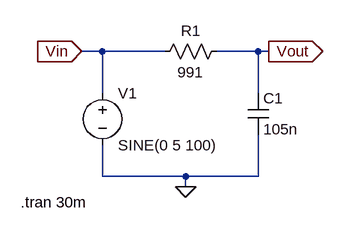
[diagram p0: schematic Draft8.asc]
Draft8.asc, the LTspice schematic file:
Version 4
SHEET 1 880 680
WIRE 16 48 -16 48
WIRE 112 48 16 48
WIRE 256 48 192 48
WIRE 272 48 256 48
WIRE 16 112 16 48
WIRE 256 112 256 48
WIRE 16 240 16 192
WIRE 144 240 16 240
WIRE 256 240 256 176
WIRE 256 240 144 240
WIRE 144 256 144 240
FLAG 144 256 0
FLAG -16 48 Vin
IOPIN -16 48 In
FLAG 272 48 Vout
IOPIN 272 48 Out
SYMBOL res 208 32 R90
WINDOW 0 0 56 VBottom 2
WINDOW 3 32 56 VTop 2
SYMATTR InstName R1
SYMATTR Value 991
SYMBOL cap 240 112 R0
SYMATTR InstName C1
SYMATTR Value 105n
SYMBOL voltage 16 96 R0
WINDOW 123 0 0 Left 0
WINDOW 39 0 0 Left 0
SYMATTR InstName V1
SYMATTR Value SINE(0 5 100)
TEXT -110 280 Left 2 !.tran 30m

The netlist it stands for:
* Draft8.asc
R1 Vout Vin 991
C1 Vout 0 105n
V1 Vin 0 SINE(0 5 100)
.tran 30m
.backanno
.end

* Results of the author's LTspice run, read from the files saved beside the schematic
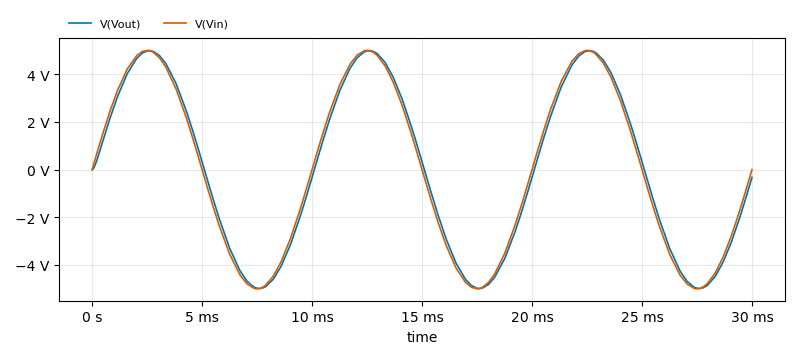
[diagram p1: Transient Analysis of Draft8.asc, plotted from the saved traces]
* Transient Analysis, 1 run:
*   V(Vout): min -4.989 V, max 4.989 V, average 975.1 µV, rms 3.527 V, last -325.5 mV
*   V(Vin): min -5 V, max 5 V, average -161.8 µV, rms 3.535 V, last 0 V